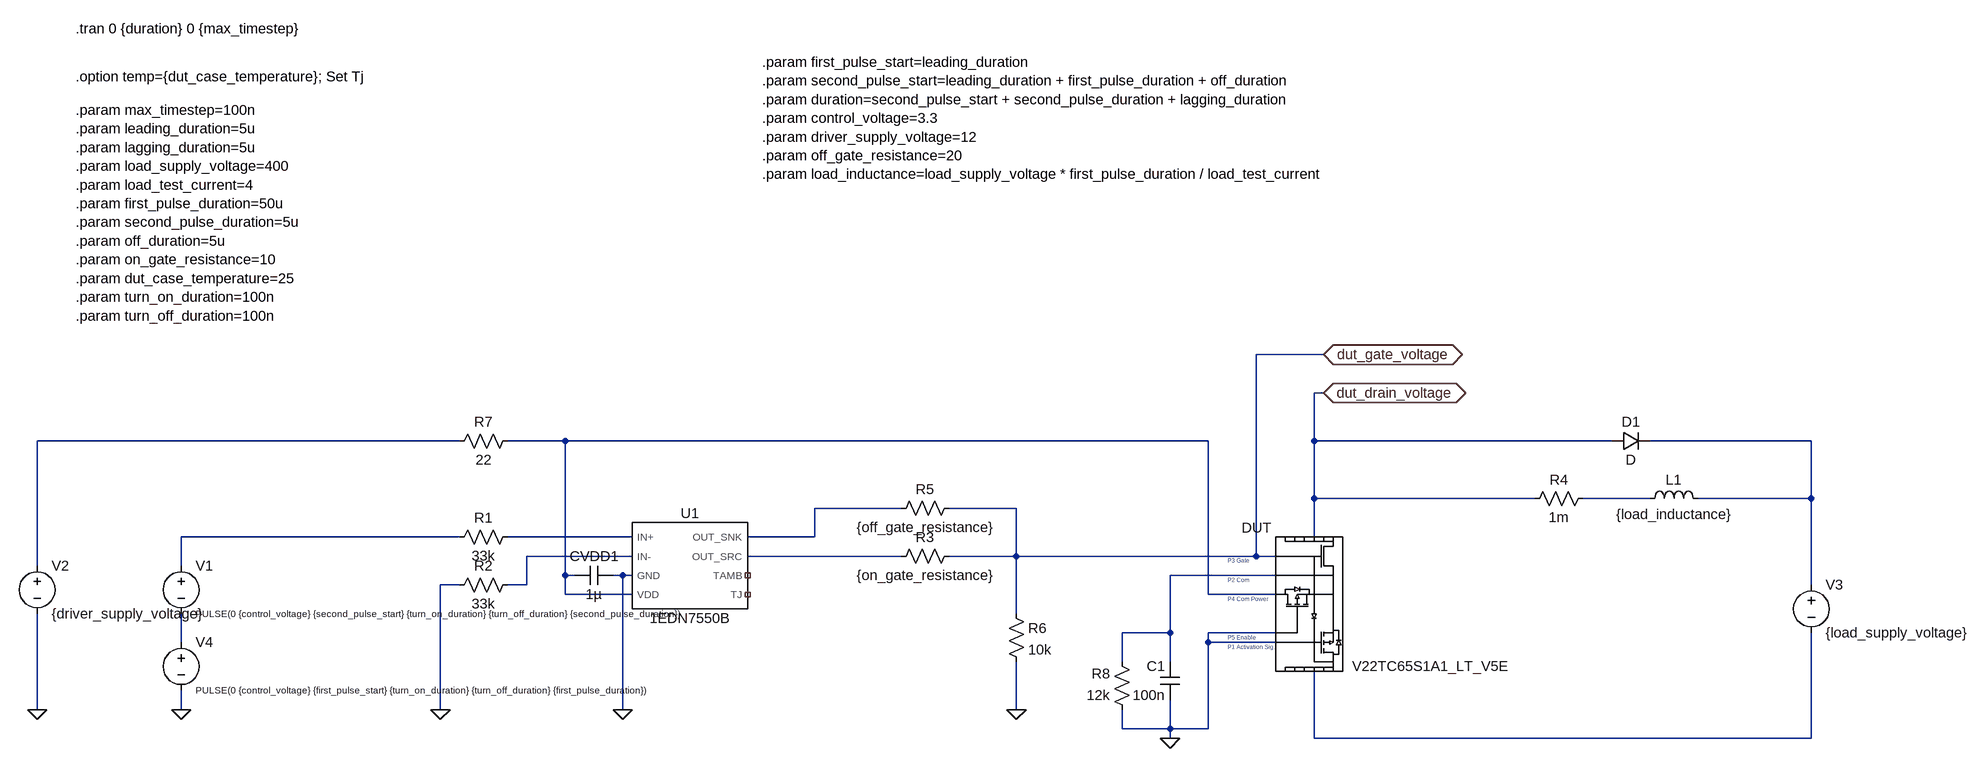
[diagram p0: schematic double_pulse_test_gan_v22tc65s1a1.asc]
double_pulse_test_gan_v22tc65s1a1.asc, the LTspice schematic file:
Version 4
SHEET 1 2216 1352
WIRE 992 336 880 336
WIRE 992 400 976 400
WIRE -448 480 -1152 480
WIRE -272 480 -368 480
WIRE 800 480 -272 480
WIRE 976 480 976 400
WIRE 1472 480 976 480
WIRE 1920 480 1536 480
WIRE 976 576 976 480
WIRE 1344 576 976 576
WIRE 1536 576 1424 576
WIRE 1920 576 1920 480
WIRE 1920 576 1616 576
WIRE 288 592 144 592
WIRE 480 592 368 592
WIRE -448 640 -912 640
WIRE -160 640 -368 640
WIRE 144 640 144 592
WIRE 144 640 32 640
WIRE 976 640 976 576
WIRE -160 672 -336 672
WIRE 288 672 32 672
WIRE 480 672 480 592
WIRE 480 672 368 672
WIRE 880 672 880 336
WIRE 880 672 480 672
WIRE 912 672 880 672
WIRE -1152 688 -1152 480
WIRE -912 688 -912 640
WIRE -272 704 -272 480
WIRE -256 704 -272 704
WIRE -176 704 -192 704
WIRE -160 704 -176 704
WIRE 912 704 736 704
WIRE -448 720 -480 720
WIRE -336 720 -336 672
WIRE -336 720 -368 720
WIRE 1920 720 1920 576
WIRE -272 736 -272 704
WIRE -160 736 -272 736
WIRE 800 736 800 480
WIRE 912 736 800 736
WIRE 480 768 480 672
WIRE 736 800 736 704
WIRE 736 800 656 800
WIRE 912 800 800 800
WIRE -912 816 -912 768
WIRE 800 816 800 800
WIRE 912 816 800 816
WIRE 656 848 656 800
WIRE 736 848 736 800
WIRE -1152 928 -1152 768
WIRE -912 928 -912 896
WIRE -480 928 -480 720
WIRE -176 928 -176 704
WIRE 480 928 480 848
WIRE 656 960 656 928
WIRE 736 960 736 912
WIRE 736 960 656 960
WIRE 800 960 800 816
WIRE 800 960 736 960
WIRE 736 976 736 960
WIRE 976 976 976 864
WIRE 1920 976 1920 800
WIRE 1920 976 976 976
FLAG -480 928 0
FLAG -912 928 0
FLAG -1152 928 0
FLAG -176 928 0
FLAG 992 400 dut_drain_voltage
IOPIN 992 400 BiDir
FLAG 992 336 dut_gate_voltage
IOPIN 992 336 BiDir
FLAG 480 928 0
FLAG 736 976 0
SYMBOL 1EDN7550B -64 688 R0
SYMATTR InstName U1
SYMBOL res -352 624 R90
WINDOW 0 0 56 VBottom 2
WINDOW 3 32 56 VTop 2
SYMATTR InstName R1
SYMATTR Value 33k
SYMBOL res -352 704 R90
WINDOW 0 0 56 VBottom 2
WINDOW 3 32 56 VTop 2
SYMATTR InstName R2
SYMATTR Value 33k
SYMBOL voltage -912 672 R0
WINDOW 123 0 0 Left 0
WINDOW 39 0 0 Left 0
WINDOW 3 24 96 Left 1
SYMATTR Value PULSE(0 {control_voltage} {second_pulse_start} {turn_on_duration} {turn_off_duration} {second_pulse_duration})
SYMATTR InstName V1
SYMBOL cap -192 688 R90
WINDOW 0 0 32 VBottom 2
WINDOW 3 32 32 VTop 2
SYMATTR InstName CVDD1
SYMATTR Value 1µ
SYMBOL voltage -1152 672 R0
WINDOW 123 0 0 Left 0
WINDOW 39 0 0 Left 0
SYMATTR InstName V2
SYMATTR Value {driver_supply_voltage}
SYMBOL res 384 656 R90
WINDOW 0 0 56 VBottom 2
WINDOW 3 32 56 VTop 2
SYMATTR InstName R3
SYMATTR Value {on_gate_resistance}
SYMBOL voltage 1920 704 R0
WINDOW 123 0 0 Left 0
WINDOW 39 0 0 Left 0
SYMATTR InstName V3
SYMATTR Value {load_supply_voltage}
SYMBOL res 1440 560 R90
WINDOW 0 0 56 VBottom 2
WINDOW 3 32 56 VTop 2
SYMATTR InstName R4
SYMATTR Value 1m
SYMBOL ind 1520 592 R270
WINDOW 0 32 56 VTop 2
WINDOW 3 5 56 VBottom 2
SYMATTR InstName L1
SYMATTR Value {load_inductance}
SYMBOL res 384 576 R90
WINDOW 0 0 56 VBottom 2
WINDOW 3 32 56 VTop 2
SYMATTR InstName R5
SYMATTR Value {off_gate_resistance}
SYMBOL voltage -912 800 R0
WINDOW 123 0 0 Left 0
WINDOW 39 0 0 Left 0
WINDOW 3 24 96 Left 1
SYMATTR Value PULSE(0 {control_voltage} {first_pulse_start} {turn_on_duration} {turn_off_duration} {first_pulse_duration})
SYMATTR InstName V4
SYMBOL res 464 752 R0
SYMATTR InstName R6
SYMATTR Value 10k
SYMBOL res -352 464 R90
WINDOW 0 0 56 VBottom 2
WINDOW 3 32 56 VTop 2
SYMATTR InstName R7
SYMATTR Value 22
SYMBOL V22TC65S1A1_LT_V5E 976 736 R0
WINDOW 3 194 104 Top 2
SYMATTR InstName DUT
SYMBOL cap 752 912 R180
WINDOW 0 24 56 Left 2
WINDOW 3 24 8 Left 2
SYMATTR InstName C1
SYMATTR Value 100n
SYMBOL res 672 944 R180
WINDOW 0 36 76 Left 2
WINDOW 3 36 40 Left 2
SYMATTR InstName R8
SYMATTR Value 12k
SYMBOL diode 1472 496 R270
WINDOW 0 32 32 VTop 2
WINDOW 3 0 32 VBottom 2
SYMATTR InstName D1
TEXT -1088 -208 Left 2 !.tran 0 {duration} 0 {max_timestep}
TEXT -1088 -128 Left 2 !.option temp={dut_case_temperature}; Set Tj
TEXT -1088 -72 Left 2 !.param max_timestep=100n\n.param leading_duration=5u\n.param lagging_duration=5u\n.param load_supply_voltage=400\n.param load_test_current=4\n.param first_pulse_duration=50u\n.param second_pulse_duration=5u\n.param off_duration=5u\n.param on_gate_resistance=10\n.param dut_case_temperature=25\n.param turn_on_duration=100n\n.param turn_off_duration=100n
TEXT 56 -152 Left 2 !.param first_pulse_start=leading_duration\n.param second_pulse_start=leading_duration + first_pulse_duration + off_duration\n.param duration=second_pulse_start + second_pulse_duration + lagging_duration\n.param control_voltage=3.3\n.param driver_supply_voltage=12\n.param off_gate_resistance=20\n.param load_inductance=load_supply_voltage * first_pulse_duration / load_test_current
TEXT 832 744 Left 0 ;P4 Com Power
TEXT 832 712 Left 0 ;P2 Com
TEXT 832 680 Left 0 ;P3 Gate
TEXT 832 808 Left 0 ;P5 Enable
TEXT 832 824 Left 0 ;P1 Activation Sig.

The netlist it stands for:
* double_pulse_test_gan_v22tc65s1a1.asc
XU1 N007 N008 0 N002 N005 N009 NC_01 NC_02 1EDN7550B  ; pins IN+ IN- GND VDD OUT_SNK OUT_SRC TAMB TJ
R1 N007 N006 33k
R2 N008 0 33k
V1 N006 N011 PULSE(0 {control_voltage} {second_pulse_start} {turn_on_duration} {turn_off_duration} {second_pulse_duration})
CVDD1 0 N002 1µ
V2 N001 0 {driver_supply_voltage}
R3 dut_gate_voltage N009 {on_gate_resistance}
V3 N003 N012 {load_supply_voltage}
R4 N004 dut_drain_voltage 1m
L1 N004 N003 {load_inductance}
R5 dut_gate_voltage N005 {off_gate_resistance}
V4 N011 0 PULSE(0 {control_voltage} {first_pulse_start} {turn_on_duration} {turn_off_duration} {first_pulse_duration})
R6 dut_gate_voltage 0 10k
R7 N002 N001 22
XDUT 0 N010 dut_gate_voltage N002 0 dut_drain_voltage N012 V22TC65S1A1_LT_V5E  ; pins As Cs G Cp En D S
C1 0 N010 100n
R8 0 N010 12k
D1 dut_drain_voltage N003 D
.model D D
.lib standard.dio
.tran 0 {duration} 0 {max_timestep}
.option temp={dut_case_temperature}; Set Tj
.param max_timestep=100n
.param leading_duration=5u
.param lagging_duration=5u
.param load_supply_voltage=400
.param load_test_current=4
.param first_pulse_duration=50u
.param second_pulse_duration=5u
.param off_duration=5u
.param on_gate_resistance=10
.param dut_case_temperature=25
.param turn_on_duration=100n
.param turn_off_duration=100n
.param first_pulse_start=leading_duration
.param second_pulse_start=leading_duration + first_pulse_duration + off_duration
.param duration=second_pulse_start + second_pulse_duration + lagging_duration
.param control_voltage=3.3
.param driver_supply_voltage=12
.param off_gate_resistance=20
.param load_inductance=load_supply_voltage * first_pulse_duration / load_test_current
* P4 Com Power
* P2 Com
* P3 Gate
* P5 Enable
* P1 Activation Sig.
.lib C:\Users\joshu\OneDrive - Stellenbosch University\Obsidian\Postgraduate Vault\Areas\RU Electronics and Drives\Resources\Spice Models\Infineon-Non_isolated_Gate_Driver_IC_1EDN7550B_Spice-SimulationModels-v01_00-EN\Model\1EDN7550B.lib
.lib V22TC65S1A1_LT_V5E.lib
.backanno
.end